# Altium schematic sheet Microcontroller.SchDoc
size 420 x 297 mm; SheetNumber: 2; SheetTotal: 4
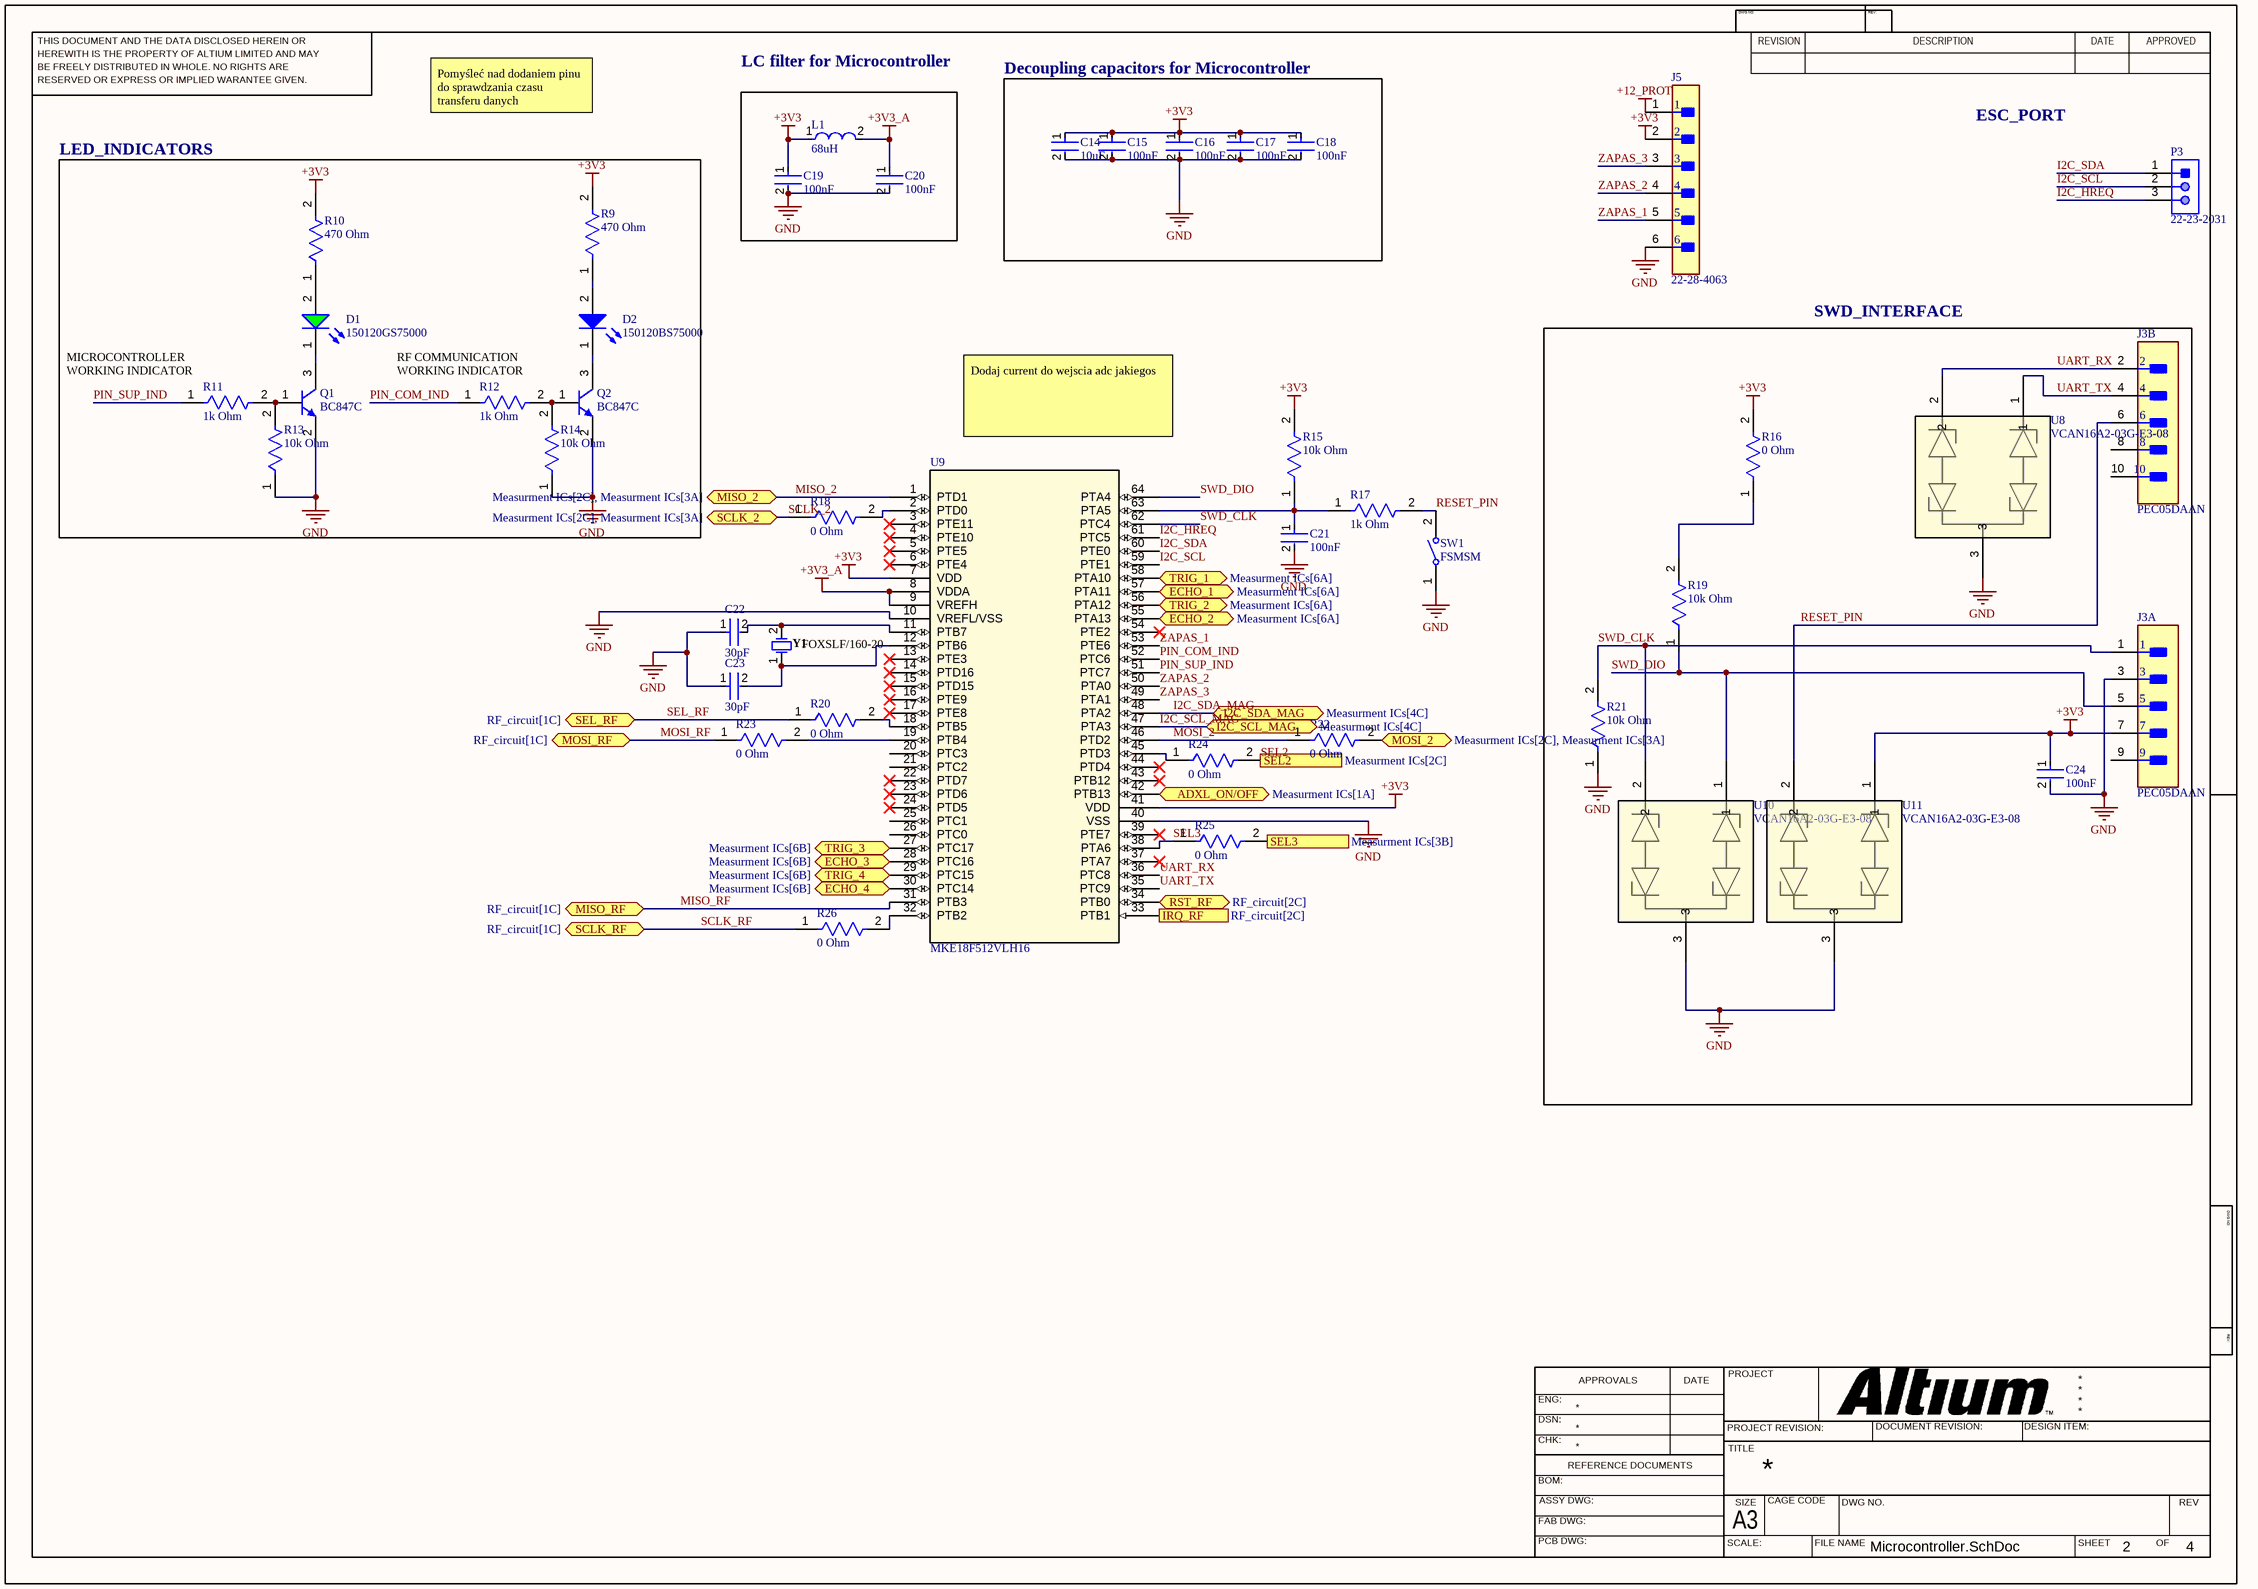
[diagram p0: Microcontroller.SchDoc]

## Parts
C14  10uF  [FP-CC0805-0_85-MFG]
C15  100nF  [FP-CC0805-0_85-MFG]
C16  100nF  [FP-CC0805-0_85-MFG]
C17  100nF  [FP-CC0805-0_85-MFG]
C18  100nF  [FP-CC0805-0_85-MFG]
C19  100nF  [FP-CC0805-0_85-MFG]
C20  100nF  [FP-CC0805-0_85-MFG]
C21  100nF  [FP-CC0805-0_85-MFG]
C22  30pF  [FP-CC0805-0_85-MFG]
C23  30pF  [FP-CC0805-0_85-MFG]
C24  100nF  [FP-CC0805-0_85-MFG]
D1  150120GS75000  [WL-SMCW_1206_150120xx75000]
D2  150120BS75000  [WL-SMCW_1206_150120xx75000]
J3  PEC05DAAN  [FP-PEC05DAAN-MFG]  (parts A,B of 2)
J5  22-28-4063  [FP-22-28-4063-MFG]
L1  68uH  [FP-CB2518-MFG]
P3  22-23-2031  [MOLX-22-23-2031_V]
Q1  BC847C  [INF-SOT23_L]
Q2  BC847C  [INF-SOT23_L]
R9  470 Ohm  [FP-RMCF0805-MFG]
R10  470 Ohm  [FP-RMCF0805-MFG]
R11  1k Ohm  [FP-RMCF0805-MFG]
R12  1k Ohm  [FP-RMCF0805-MFG]
R13  10k Ohm  [FP-RMCF0805-MFG]
R14  10k Ohm  [FP-RMCF0805-MFG]
R15  10k Ohm  [FP-RMCF0805-MFG]
R16  0 Ohm  [FP-RMCF0805-MFG]
R17  1k Ohm  [FP-RMCF0805-MFG]
R18  0 Ohm  [FP-RMCF0805-MFG]
R19  10k Ohm  [FP-RMCF0805-MFG]
R20  0 Ohm  [FP-RMCF0805-MFG]
R21  10k Ohm  [FP-RMCF0805-MFG]
R22  0 Ohm  [FP-RMCF0805-MFG]
R23  0 Ohm  [FP-RMCF0805-MFG]
R24  0 Ohm  [FP-RMCF0805-MFG]
R25  0 Ohm  [FP-RMCF0805-MFG]
R26  0 Ohm  [FP-RMCF0805-MFG]
SW1  FSMSM  [TECO-FSMSM-2_V]
U8  VCAN16A2-03G-E3-08  [SOT_3G-E3-08_VIS]
U9  MKE18F512VLH16  [LQFP64-10x10_NXP]
U10  VCAN16A2-03G-E3-08  [SOT_3G-E3-08_VIS]
U11  VCAN16A2-03G-E3-08  [SOT_3G-E3-08_VIS]
Y1  FOXSLF/160-20  [FOX-FOXSLF160-20]

## Blocks framed on the sheet
Decoupling capacitors for Microcontroller: C14-C18
LED_INDICATORS: D1 D2 Q1 Q2 R9-R14
SWD_INTERFACE: C24 J3 R16 R19 R21 U8 U10 U11

## Ports
ADXL_ON/OFF (bidir, see Measurment ICs[1A]), ECHO_1 (bidir, see Measurment ICs[6A]), ECHO_2 (bidir, see Measurment ICs[6A]), ECHO_3 (bidir, see Measurment ICs[6B]), ECHO_4 (bidir, see Measurment ICs[6B]), I2C_SCL_MAG (bidir, see Measurment ICs[4C]), I2C_SDA_MAG (bidir, see Measurment ICs[4C]), IRQ_RF (in, see RF_circuit[2C]), MISO_2 (bidir, see Measurment ICs[2C], Measurment ICs[3A]), MISO_RF (bidir, see RF_circuit[1C]), MOSI_2 (bidir, see Measurment ICs[2C], Measurment ICs[3A]), MOSI_RF (bidir, see RF_circuit[1C]), RST_RF (bidir, see RF_circuit[2C]), SCLK_2 (bidir, see Measurment ICs[2C], Measurment ICs[3A]), SCLK_RF (bidir, see RF_circuit[1C]), SEL2 (out, see Measurment ICs[2C]), SEL3 (out, see Measurment ICs[3B]), SEL_RF (bidir, see RF_circuit[1C]), TRIG_1 (bidir, see Measurment ICs[6A]), TRIG_2 (bidir, see Measurment ICs[6A]), TRIG_3 (bidir, see Measurment ICs[6B]), TRIG_4 (bidir, see Measurment ICs[6B])

## Nets
+3V3: C14.1 C15.1 C16.1 C17.1 C18.1 C19.1 C24.1 J3.7 J5.2 L1.1 R9.2 R10.2 R15.2 R16.2 U9.7(VDD) U9.41(VDD) U11.1
+3V3_A: C20.1 L1.2 U9.8(VDDA) U9.9(VREFH)
+12_PROT: J5.1
GND: C14.2 C15.2 C16.2 C17.2 C18.2 C19.2 C20.2 C21.2 C22.1 C23.1 C24.2 J3.3 J5.6 Q1.2(E) Q2.2(E) R13.1 R14.1 R21.1 SW1.1 U8.3 U9.10(VREFL/VSS) U9.40(VSS) U10.3 U11.3
ADXL_ON/OFF: U9.42(PTB13) ; port ADXL_ON/OFF
ECHO_1: U9.57(PTA11) ; port ECHO_1
ECHO_2: U9.55(PTA13) ; port ECHO_2
ECHO_3: U9.28(PTC16) ; port ECHO_3
ECHO_4: U9.30(PTC14) ; port ECHO_4
I2C_HREQ: P3.3 U9.61(PTC5)
I2C_SCL: P3.2 U9.59(PTE1)
I2C_SCL_MAG: U9.47(PTA3) ; port I2C_SCL_MAG
I2C_SDA: P3.1 U9.60(PTE0)
I2C_SDA_MAG: U9.48(PTA2) ; port I2C_SDA_MAG
IRQ_RF: U9.33(PTB1) ; port IRQ_RF
MISO_2: U9.1(PTD1) ; port MISO_2
MISO_RF: U9.31(PTB3) ; port MISO_RF
MOSI_2: R22.1 U9.46(PTD2)
MOSI_2: R22.2 ; port MOSI_2  [a separate net that carries the same name]
MOSI_RF: R23.1 ; port MOSI_RF
PIN_COM_IND: R12.1 U9.52(PTC6)
PIN_SUP_IND: R11.1 U9.51(PTC7)
RESET_PIN: J3.6 R17.2 SW1.2 U11.2
RST_RF: U9.34(PTB0) ; port RST_RF
SCLK_2: R18.1 ; port SCLK_2
SCLK_RF: R26.1 ; port SCLK_RF
SEL2: R24.2 ; port SEL2
SEL3: R25.1 U9.38(PTA6)
SEL3: R25.2 ; port SEL3  [a separate net that carries the same name]
SEL_RF: R20.1 ; port SEL_RF
SWD_CLK: J3.1 R21.2 U9.62(PTC4) U10.2
SWD_DIO: J3.5 R19.1 U9.64(PTA4) U10.1
TRIG_1: U9.58(PTA10) ; port TRIG_1
TRIG_2: U9.56(PTA12) ; port TRIG_2
TRIG_3: U9.27(PTC17) ; port TRIG_3
TRIG_4: U9.29(PTC15) ; port TRIG_4
UART_RX: J3.2 U8.2 U9.36(PTC8)
UART_TX: J3.4 U8.1 U9.35(PTC9)
ZAPAS_1: J5.5 U9.53(PTE6)
ZAPAS_2: J5.4 U9.50(PTA0)
ZAPAS_3: J5.3 U9.49(PTA1)
NetC21_1: C21.1 R15.1 R17.1 U9.63(PTA5)
NetC22_2: C22.2 U9.11(PTB7) Y1.2
NetC23_2: C23.2 U9.12(PTB6) Y1.1
NetD1_1: D1.1(K) Q1.3(C)
NetD1_2: D1.2(A) R10.1
NetD2_1: D2.1(K) Q2.3(C)
NetD2_2: D2.2(A) R9.1
NetQ1_1: Q1.1(B) R11.2 R13.2
NetQ2_1: Q2.1(B) R12.2 R14.2
NetR16_1: R16.1 R19.2
NetR18_2: R18.2 U9.2(PTD0)
NetR20_2: R20.2 U9.18(PTB5)
NetR23_2: R23.2 U9.19(PTB4)
NetR24_1: R24.1 U9.45(PTD3)
NetR26_2: R26.2 U9.32(PTB2)

Not connected (* = marked no-connect by the designer): J3 8 9 10; U9 3(PTE11)* 4(PTE10)* 5(PTE5)* 6(PTE4)* 13(PTE3)* 14(PTD16)* 15(PTD15)* 16(PTE9)* 17(PTE8)* 20(PTC3) 21(PTC2) 22(PTD7)* 23(PTD6)* 24(PTD5)* 25(PTC1) 26(PTC0) 37(PTA7)* 39(PTE7)* 43(PTB12)* 44(PTD4)* 54(PTE2)*

## Notes on the sheet
- Pomyśleć nad dodaniem pinu do sprawdzania czasu transferu danych
- LC filter for Microcontroller
- ESC_PORT
- (near R11) MICROCONTROLLER WORKING INDICATOR
- (near R12) RF COMMUNICATION WORKING INDICATOR
- Dodaj current do wejscia adc jakiegos
- THIS DOCUMENT AND THE DATA DISCLOSED HEREIN OR
- HEREWITH IS THE PROPERTY OF ALTIUM LIMITED AND MAY
- DWG NO:
- REVISION
- REV:
- DESCRIPTION
- DATE
- APPROVED
- BE FREELY DISTRIBUTED IN WHOLE. NO RIGHTS ARE
- RESERVED OR EXPRESS OR IMPLIED WARANTEE GIVEN.
- ENG:
- APPROVALS
- PROJECT
- DSN:
- CHK:
- REFERENCE DOCUMENTS
- PROJECT REVISION:
- TITLE
- DOCUMENT REVISION:
- DESIGN ITEM:
- BOM:
- FAB DWG:
- PCB DWG:
- ASSY DWG:
- SCALE:
- A3
- SIZE
- CAGE CODE
- FILE NAME
- DWG NO.
- SHEET
- OF
- REV

## Library data of the parts
C14 C22 C23 = CMP-2100-03606-3: CAP CER 0.1UF 50V X7R 0805; Manufacturer Part Number: CC0805KRX7R9BB104; Manufacturer: Yageo; Tolerance: 0.1; Capacitance: 100 nF; Value: 100 nF; Material: Ceramic; Device Class L1: Passive Components; ComponentLink2Description: Datasheet; Package: CC0805-0.85; Digikey Description: CAP CER 0.1UF 50V X7R 0805; Device Class L3: Ceramic Capacitors; Temperature: -30°C to +85°C; Temperature Characteristic: X7R; Voltage Rating: 50 V; Height: 0.95mm; RoHS: TRUE; Ipc Land Pattern Name: CAPC200125X85; Device Class L2: Capacitors; Category: Cap; Temperature Range Low: -30°C; Temperature Range High: +85°C; Mouser Description: Multilayer Ceramic Capacitors MLCC - SMD/SMT 100nF 50V X7R 10%; Footprint Url: http://www.yageo.com/exep/pages/download/literatures/UPY-C_GEN_24.pdf; Automotive: No; Octopart: https://octopart.com/cc0805krx7r9bb104-yageo-192993; Lead Free: Yes; ComponentLink2URL: http://www.yageo.com/documents/recent/UPY-GPHC_Y5V_6.3V-to-50V_8.pdf
C15-C21 C24 = CMP-2100-03606-3: CAP CER 0.1UF 50V X7R 0805; Manufacturer Part Number: CC0805KRX7R9BB104; Manufacturer: Yageo; Tolerance: 0.1; Material: Ceramic; Device Class L1: Passive Components; ComponentLink2Description: Datasheet; Package: CC0805-0.85; Digikey Description: CAP CER 0.1UF 50V X7R 0805; Capacitance: 100 nF; Device Class L3: Ceramic Capacitors; Value: 100 nF; Temperature: -30°C to +85°C; Temperature Characteristic: X7R; Voltage Rating: 50 V; Height: 0.95mm; RoHS: TRUE; Ipc Land Pattern Name: CAPC200125X85; Device Class L2: Capacitors; Category: Cap; Temperature Range Low: -30°C; Temperature Range High: +85°C; Mouser Description: Multilayer Ceramic Capacitors MLCC - SMD/SMT 100nF 50V X7R 10%; Footprint Url: http://www.yageo.com/exep/pages/download/literatures/UPY-C_GEN_24.pdf; Automotive: No; Octopart: https://octopart.com/cc0805krx7r9bb104-yageo-192993; Lead Free: Yes; ComponentLink2URL: http://www.yageo.com/documents/recent/UPY-GPHC_Y5V_6.3V-to-50V_8.pdf
D1 = CMP-1426-00014-4: WL-SMCW SMT Mono-Color Chip LED Waterclear; Dominant Wavelength: 525nm; Reverse Voltage: 5V; Max Junction Temperature (Tj): 95°C; Lens Style: Clear, Rectangular; Forward Voltage: 3.2V; Power Dissipation: 105mW; Peak Wavelength: 515nm; Test Current: 20mA; Color: Green; Forward Current: 100mA; Luminous Intensity: 450mcd; Viewing Angle: 140°; Case Code (Imperial): 1206; REACH SVHC: Unknown; Packaging: Tape and Reel; Max Operating Temperature: 85°C; Case/Package: 1206; Height: 680µm; Length: 3.2mm; Mount: Surface Mount; Min Operating Temperature: -40°C; Width: 1.6mm; Case Code (Metric): 3216; Max Reverse Voltage (DC): 5V; RoHS: Compliant; Wavelength: 525nm
D2 = CMP-1426-00015-3: WL-SMCW SMT Mono-Color Chip LED Waterclear; Manufacturer Package Identifier: LED_1206; Dominant Wavelength: 470nm; Lens Style: Clear, Rectangular; Test Current: 20mA; Forward Voltage: 3.2V; Forward Current: 100mA; Peak Wavelength: 465nm; Max Reverse Voltage (DC): 5V; Viewing Angle: 140°; Color: Blue; Luminous Intensity: 145mcd; Max Operating Temperature: 85°C; Case Code (Imperial): 1206; Length: 3.2mm; Width: 1.6mm; Min Operating Temperature: -40°C; Height: 680µm; Case Code (Metric): 3216; Packaging: Tape and Reel; RoHS: Compliant; Case/Package: 1206; REACH SVHC: Unknown; Wavelength: 470nm; Mount: Surface Mount
J3 = CMP-25680-000034-1: CONN HEADER VERT 10POS 2.54MM; Pitch: 0.1inch; Number of Positions: 10; Gender: Male; Connector Type: Male Pin; Contact Type: Male Pin; Height: 2.54mm; Termination: Solder; Packaging: Bulk; Housing Material: Plastic; Contact Mating Length: 0.23inch; Width: 5.08mm; Row Spacing: 0.1inch; Housing Color: Black; Mount: Through Hole; Contact Plating: Tin; Contact Material: Bronze; Color: Black; Package Quantity: 1; Length: 12.7mm; Lead Free: Lead Free; Number of Rows: 2; Number of Contacts: 10
J5 = CMP-04776-000885-1: CONN HEADER VERT 6POS 2.54MM; Number of Circuits: 6; Voltage Rating (DC): 250V; Connector Type: Male Pin; Contact Resistance: 20mR; Glow Wire Compliant: Non-compliant; Gender: Male; Current Rating: 4A; Max Voltage Rating (DC): 250.25kV; Series: KK® 42375; Termination: Solder; Orientation: Straight; Max Operating Temperature: 75°C; Min Operating Temperature: 0°C; Mount: Through Hole; Depth: 2.49mm; Contact Material: Brass; Number of Positions: 6; Contact Mating Length: 0.24inch; Number of Rows: 1; Housing Color: Black; Max Voltage Rating (AC): 250V; Housing Material: Thermoplastic; Packaging: Bulk; Contact Plating: Gold; Contact Type: Male Pin; Package Quantity: 1; Number of Contacts: 6; Voltage Rating: 250V; Lead Free: Lead Free; RoHS Compliant: Yes; Pitch: 2.54mm; Color: Black; Flammability Rating: UL94 V-0; Radiation Hardening: No
L1 = CMP-14484-000100-1: SMD Inductors 68uH ±10% 0.31A 1.95Ω 1007; Test Frequency: 2.52MHz; Max DC Current: 310mA; Saturation Current: 70mA; DC Resistance (DCR): 1.95R; Core Material: Ferrite; Self Resonant Frequency: 9.5MHz; Shielding: Unshielded; Inductance: 68uH; Case Code (Imperial): 1007; RoHS Compliant: Yes; Mount: Surface Mount; Package Quantity: 2000; Case/Package: 1007; Packaging: Tape and Reel; Length: 0.098inch; Resistor Type: Wirewound; Height: 1.8mm; Termination: SMD/SMT; Current Rating: 310mA; Tolerance: 10%; Height - Seated (Max): 0.079inch; Min Operating Temperature: -40°C; Depth: 2mm; Inductance Tolerance: 10%; Max Operating Temperature: 105°C; Width: 0.071inch; Halogen Free: Halogen Free; Case Code (Metric): 2518; Series: CB; Radiation Hardening: No
P3 = CMP-2000-05242-1: Male Header, Pitch 2.54 mm, 1 x 3 Position, Height 8.18 mm, Tail Length 3.56 mm, RoHS, Bulk; Current Rating: 4A; Brand: Molex; Pitch: 2.54mm; Voltage Rating: 250V; Mounting Angle: Vertical; Type: Locking; Factory Pack Quantity: 16000; Tradename: KK; Housing Material: Nylon; Contact Material: Brass; Manufacturer URL: http://www.molex.com/; Termination Style: ThroughHole; Mounting Style: ThroughHole; Number of Positions: 3Position; Contact Gender: Pin(Male); Packaging: Bulk; Series: 6373; Datasheet Version: Sep-01; Contact Plating: Tin; Product: Headers; Datasheet URL: https://datasheet.ciiva.com/19472/232274-19472863.pdf; RoHS: Details; Product Category: Headers&WireHousings; Manufacturer: Molex; Number of Rows: 1Row
Q1 Q2 = CMP-1177-00037-1: NPN Silicon AF Transistor, 45 V VCEO, 100 mA IC, SOT23, Reel, Green; Manufacturer: Infineon; VCEO (max): 45Â V; VEBO (max): 6Â V; fT (typ): 250Â MHz; VCBO (max): 50Â V; ICM (max): 200Â mA; Green: TRUE; IC (max): 100Â mA; Ptot (max): 330Â mW; ICBO (max): 15Â nA; PartNumber: BC847C; ComponentLink3URL: http://www.infineon.com/dgdl/SOT23-Package_Overview.pdf?folderId=db3a30431936bc4b0119532290053c66&fileId=db3a30431936bc4b0119533468123c85; ComponentLink3Description: Package Specification; Mounting Technology: Surface Mount; PackageDescription: 3-Pin Small Outline Transistor Package, 1.3 x 2.9 mm Body, 0.95 mm Pitch; PackageReference: SOT23; ComponentLink2URL: http://www.infineon.com/dgdl/bc847series_bc848series_bc849series_bc850series.pdf?folderId=db3a304314dca389011541d30fa21656&fileId=db3a304314dca389011541d4630a1657; ComponentLink2Description: Datasheet; ComponentLink1Description: Manufacturer URL; Polarity: NPN; ComponentLink1URL: http://www.infineon.com/; IBM (max): 200Â mA; Packing: Reel; PackageVersion: Apr-08
R9-R26 = CMP-26527-000017-1: RES 0 OHM JUMPER 1/8W 0805; Power Rating: 125mW; Resistance: 0mR; Depth: 1.25mm; Length: 2mm; Military Standard: Not; Width: 0.049inch; Case Code (Imperial): 0805; Number of Terminations: 2; Mount: Surface Mount; Contact Plating: Tin; Height: 0.026inch; Case/Package: 0805; Min Operating Temperature: -55°C; Composition: Thick Film; Max Operating Temperature: 155°C; Packaging: Tape and Reel; Features: Automotive AEC-Q200; Max Power Dissipation: 125mW; Radiation Hardening: No; Lead Free: Lead Free; Case Code (Metric): 2012
SW1 = CMP-2000-07511-1: FSMSM Push Button Switch, 50 mA, -35 to 85 degC, 2-Pin SMD, RoHS, Bulk; Manufacturer: TE Connectivity; Actuator Length: 1.07mm; Electrical Life: 20000Cycles; Actuator Material: Polyamide; Current Rating: 50mA; Illumination Type: Illuminated; Voltage Rating (DC): 24V; Contact Resistance: 100mOhm; Case\/Package: SMD/SMT; Operating Force: 180gf; Switch Travel: 0.25mm; Max Voltage Rating (DC): 12V; Throw Configuration: SPST; Packaging: LoosePiece; Max Operating Temperature: 85degC; ELV: Compliant; Package Description: 2-Pin Surface Mount Device, Body 6 x 3.5 mm, Pitch 9.19 mm; RoHSCompliant: true; Manufacturer URL: http://www.te.com/; Contact Plating: Silver; Contact Material: Brass; Mounting Technology: SurfaceMount; Contact Current Rating: 50mA; Datasheet Version: Rev. C2, 08/2014; Datasheet URL: http://www.te.com/commerce/DocumentDelivery/DDEController?Action=showdoc&DocId=Customer+Drawing%7F1437566-3%7FC2%7Fpdf%7FEnglish%7FENG_CD_1437566-3_C2_1437566_3_1_c.dwg.pdf%7F1437566-3; Mechanical Life: 20000Cycles; Package Reference: FSMSM; REACH SVHC: Unknown; Orientation: Straight; Min Operating Temperature: -35degC; Lead Free: LeadFree; Termination: GullWing; Package Quantity: 1000; Mount: SurfaceMount
U8 U10 U11 = VCAN16A2-03G-E3-08: No Description Available; Mfr_Name: Vishay; RefDes: RefDes; Type: Type
U9 = MKE18F512VLH16: No Description Available; Mfr_Name: NXP; RefDes: RefDes; Type: Type
Y1 = CMP-1749-00003-1: Resistance Weld Thru-Hole Crystal, 16 MHz, -20 to 70 degC, 2-Pin THD, RoHS, Bulk; Voltage Rating: 250 V; Tolerance: 1%; Resistance: 221 kohm; Case\Package: Axial; Power Rating: 250 mW; RoHSCompliant: true; Package Quantity: 200; Packaging: Bulk; Min Operating Temperature: -55 degC; DatasheetVersion: Mar-15; ComponentLink1URL: http://www.foxonline.com/; Max Operating Temperature: 155 degC; PackageReference: FOXSLF160-20; Mount: Through Hole; PackageDescription: 2-Pin Through Hole Device, Body 11.35 x 4.65 mm; ComponentLink1Description: Manufacturer URL; ComponentLink2URL: http://www.foxonline.com/pdfs/hc49slf.pdf; ComponentLink2Description: Datasheet; Length: 0.248 inch